# EAGLE design mini-din-9 (EAGLE 6.4)
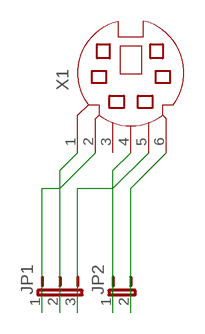
[diagram p0: schematic, sheet 1]

## Parts
JP1  JP2E  [JP2]
JP2  JP1E  [JP1]
X1  MD06SS  [MDIN06SS]

## Nets
N$1: JP1.1 X1.2
N$2: JP1.2 X1.1
N$3: JP1.3 X1.5
N$4: JP2.1 X1.4
N$5: JP2.2 X1.6
Unconnected: X1.3

## Library data of the parts
JP1 = jumper:JP2E: JUMPER
JP2 = jumper:JP1E: JUMPER
X1 = con-yamaichi:MD06SS: YAMAICHI CONNECTOR; OC_FARNELL: unknown; OC_NEWARK: unknown

## Board
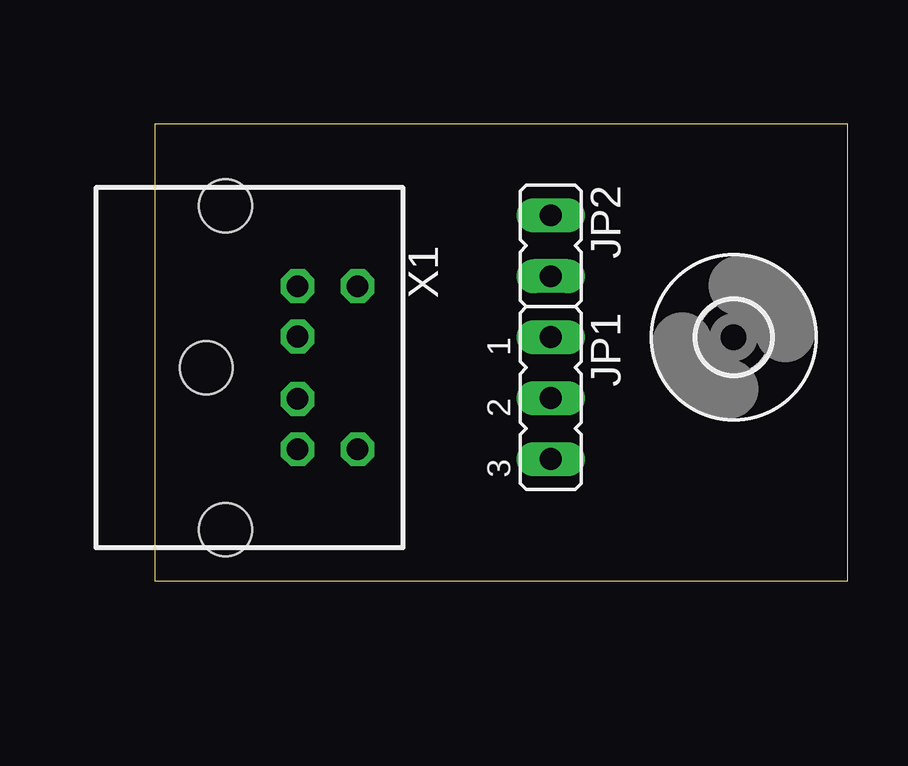
[diagram p1: board, top side]
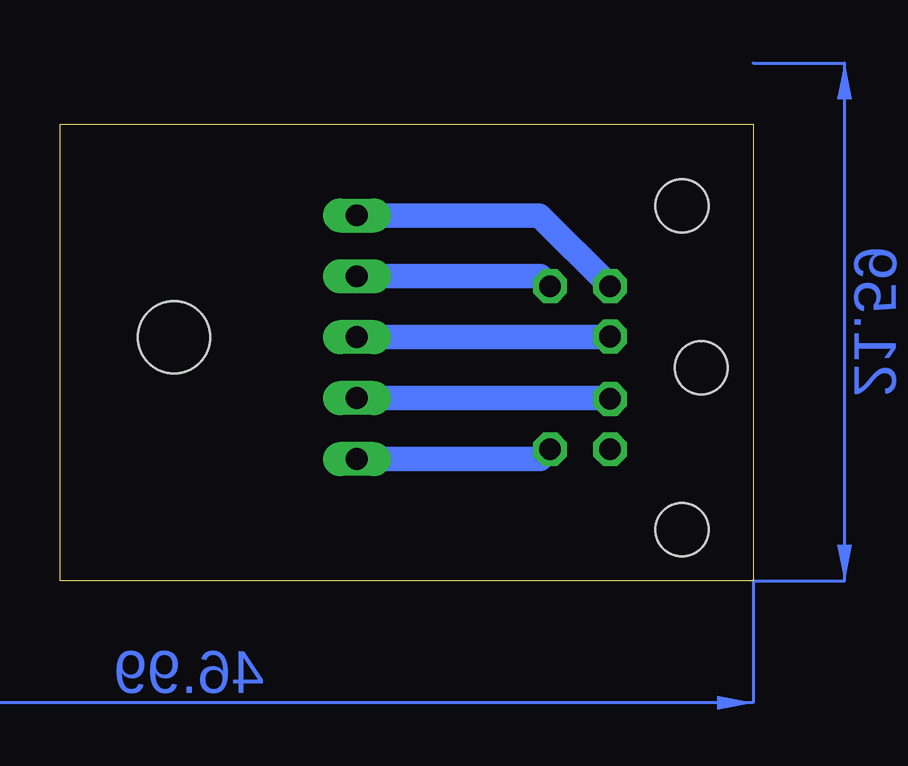
[diagram p2: board, bottom side, seen from below]

Size 28.88 x 19.04 mm. Coordinates in mm from the lower left corner, seen from the top.
Outline: 0,0 28.88,0 28.88,19.04 0,19.04 0,0
Copper layers (1*16): Top 0.035mm / dielectric 1.5mm / Bottom 0.035mm
Design rules "default": minimum track width 10mil, minimum drill 24mil, track to track 8mil, track to pad 8mil, pad to pad 8mil, via to via 8mil, smd to smd 8mil, copper to edge 40mil, drill to drill 8mil, minimum pad ring 10mil, minimum via ring 8mil, stop-mask expansion 4mil, vias tented up to drill 0mil, thermal gap 10mil

### Footprints (pad centres in the part's own frame; a part is rotated, then mirrored left to right if it is on the bottom)
JP2 = drill 0.914 long: 1 -2.54,0; 2 0,0; 3 2.54,0
JP1 = drill 0.914 long: 1 0,-1.27; 2 0,1.27
3,0 = hole 3: 0,0
MDIN06SS = drill 0.9 octagon: 1 1.3,8.5; 2 -1.3,8.5; 3 3.4,8.5; 4 -3.4,8.5; 5 3.4,11; 6 -3.4,11 | hole 2.2: -6.75,5.5; 0,4.7; 6.75,5.5

### Placement (x,y rotation side)
JP1  16.51,7.62 270 top
JP2  16.51,13.97 180 top
U$1  [3,0]  24.13,10.16 0 top
X1  -2.54,8.89 270 top

### Tracks (layer width: path | path; a pad name or v marks a point on that pad's centre or on a via)
N$1
  Bottom 1.016: X1.2 5.99,10.16 JP1.1
N$2
  Bottom 1.016: X1.1 5.99,7.62 JP1.2
N$3
  Bottom 1.016: X1.5 8.87,5.08 JP1.3
N$4
  Bottom 1.016: X1.4 8.91,15.24 JP2.1
N$5
  Bottom 1.016: X1.6 8.87,12.7 JP2.2
(copper drawn outside any net)
  shapes: Bottom area x2